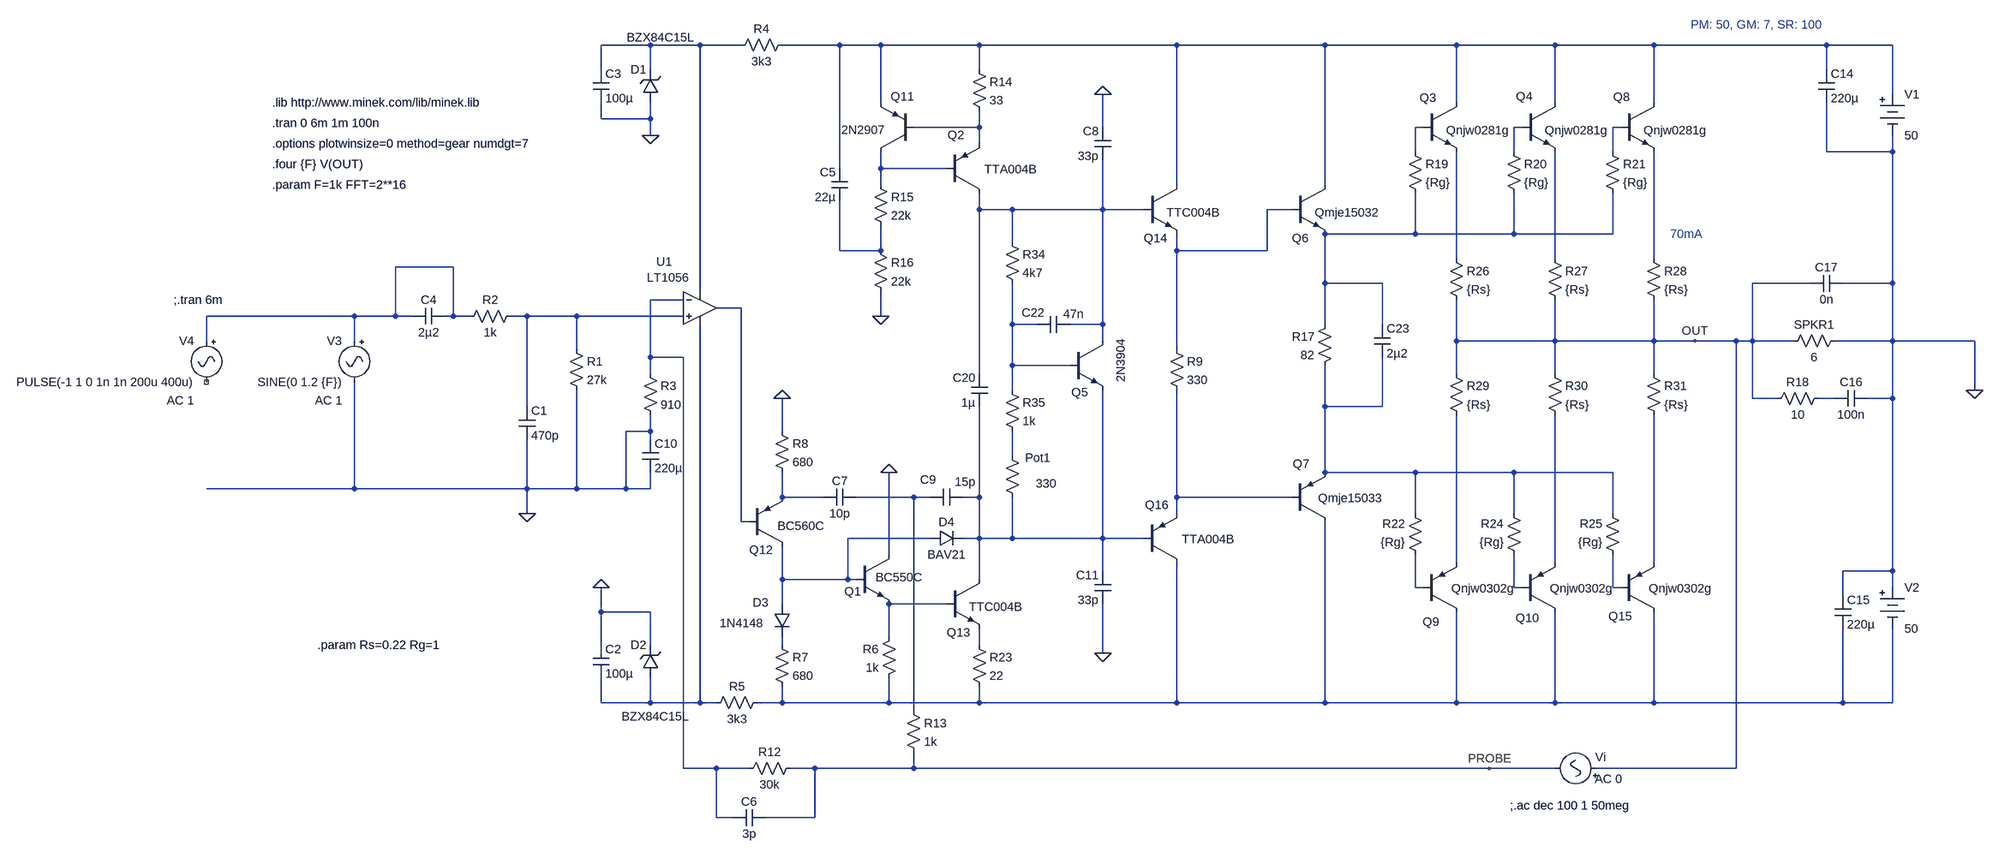
[diagram p0: schematic b44.triple.6.asc]
b44.triple.6.asc, the LTspice schematic file:
Version 4
SHEET 1 2228 832
WIRE -1952 -880 -2048 -880
WIRE -1856 -880 -1952 -880
WIRE -1776 -880 -1856 -880
WIRE -1584 -880 -1696 -880
WIRE -1504 -880 -1584 -880
WIRE -1312 -880 -1504 -880
WIRE -928 -880 -1312 -880
WIRE -640 -880 -928 -880
WIRE -384 -880 -640 -880
WIRE -192 -880 -384 -880
WIRE 0 -880 -192 -880
WIRE 336 -880 0 -880
WIRE 464 -880 336 -880
WIRE -2048 -832 -2048 -880
WIRE -1952 -832 -1952 -880
WIRE -1312 -832 -1312 -880
WIRE 336 -832 336 -880
WIRE 464 -784 464 -880
WIRE -1504 -768 -1504 -880
WIRE -384 -768 -384 -880
WIRE -192 -768 -192 -880
WIRE 0 -768 0 -880
WIRE -2048 -736 -2048 -768
WIRE -1952 -736 -1952 -768
WIRE -1952 -736 -2048 -736
WIRE -1312 -720 -1312 -752
WIRE -1312 -720 -1440 -720
WIRE -1072 -720 -1072 -784
WIRE -448 -720 -464 -720
WIRE -256 -720 -272 -720
WIRE -64 -720 -80 -720
WIRE -1952 -704 -1952 -736
WIRE -1312 -688 -1312 -720
WIRE -464 -672 -464 -720
WIRE -272 -672 -272 -720
WIRE -80 -672 -80 -720
WIRE 336 -672 336 -768
WIRE 464 -672 464 -704
WIRE 464 -672 336 -672
WIRE -1584 -640 -1584 -880
WIRE -1504 -640 -1504 -672
WIRE -1376 -640 -1504 -640
WIRE -1504 -608 -1504 -640
WIRE -928 -608 -928 -880
WIRE -640 -608 -640 -880
WIRE -1312 -560 -1312 -592
WIRE -1248 -560 -1312 -560
WIRE -1072 -560 -1072 -656
WIRE -1072 -560 -1248 -560
WIRE -992 -560 -1072 -560
WIRE -704 -560 -752 -560
WIRE -464 -512 -464 -592
WIRE -464 -512 -640 -512
WIRE -272 -512 -272 -592
WIRE -272 -512 -464 -512
WIRE -80 -512 -80 -592
WIRE -80 -512 -272 -512
WIRE -1248 -496 -1248 -560
WIRE -1584 -480 -1584 -576
WIRE -1504 -480 -1504 -528
WIRE -1504 -480 -1584 -480
WIRE -928 -480 -928 -512
WIRE -752 -480 -752 -560
WIRE -752 -480 -928 -480
WIRE -384 -464 -384 -672
WIRE -192 -464 -192 -672
WIRE 0 -464 0 -672
WIRE -2336 -448 -2448 -448
WIRE -640 -416 -640 -512
WIRE -528 -416 -640 -416
WIRE 304 -416 192 -416
WIRE 464 -416 464 -672
WIRE 464 -416 368 -416
WIRE -1856 -400 -1856 -880
WIRE -1888 -384 -1952 -384
WIRE -1776 -368 -1824 -368
WIRE -2528 -352 -2816 -352
WIRE -2448 -352 -2448 -448
WIRE -2448 -352 -2528 -352
WIRE -2416 -352 -2448 -352
WIRE -2336 -352 -2336 -448
WIRE -2336 -352 -2352 -352
WIRE -2304 -352 -2336 -352
WIRE -2192 -352 -2224 -352
WIRE -2096 -352 -2192 -352
WIRE -1888 -352 -2096 -352
WIRE -1504 -352 -1504 -400
WIRE -1248 -336 -1248 -416
WIRE -1200 -336 -1248 -336
WIRE -1072 -336 -1072 -560
WIRE -1072 -336 -1136 -336
WIRE -640 -336 -640 -416
WIRE -528 -336 -528 -416
WIRE -2816 -304 -2816 -352
WIRE -2528 -304 -2528 -352
WIRE -1072 -304 -1072 -336
WIRE -384 -304 -384 -384
WIRE -192 -304 -192 -384
WIRE -192 -304 -384 -304
WIRE 0 -304 0 -384
WIRE 0 -304 -192 -304
WIRE 80 -304 0 -304
WIRE 160 -304 80 -304
WIRE 192 -304 192 -416
WIRE 192 -304 160 -304
WIRE 272 -304 192 -304
WIRE 464 -304 464 -416
WIRE 464 -304 352 -304
WIRE 624 -304 464 -304
WIRE -2096 -288 -2096 -352
WIRE -928 -288 -928 -480
WIRE -1952 -272 -1952 -384
WIRE -1888 -272 -1952 -272
WIRE -1248 -256 -1248 -336
WIRE -1136 -256 -1248 -256
WIRE -1952 -240 -1952 -272
WIRE -1312 -240 -1312 -560
WIRE -384 -240 -384 -304
WIRE -192 -240 -192 -304
WIRE 0 -240 0 -304
WIRE -1248 -208 -1248 -256
WIRE 624 -208 624 -304
WIRE 192 -192 192 -304
WIRE 240 -192 192 -192
WIRE 352 -192 320 -192
WIRE 464 -192 464 -304
WIRE 464 -192 416 -192
WIRE -2192 -176 -2192 -352
WIRE -640 -176 -640 -256
WIRE -528 -176 -528 -272
WIRE -528 -176 -640 -176
WIRE -1952 -128 -1952 -160
WIRE -1952 -128 -2000 -128
WIRE -1696 -128 -1696 -192
WIRE -1952 -112 -1952 -128
WIRE -1248 -80 -1248 -128
WIRE -640 -48 -640 -176
WIRE -464 -48 -640 -48
WIRE -272 -48 -464 -48
WIRE -80 -48 -272 -48
WIRE -2528 -16 -2528 -224
WIRE -2528 -16 -2816 -16
WIRE -2192 -16 -2192 -112
WIRE -2192 -16 -2528 -16
WIRE -2096 -16 -2096 -208
WIRE -2096 -16 -2192 -16
WIRE -2000 -16 -2000 -128
WIRE -2000 -16 -2096 -16
WIRE -1952 -16 -1952 -48
WIRE -1952 -16 -2000 -16
WIRE -1696 0 -1696 -48
WIRE -1616 0 -1696 0
WIRE -1440 0 -1552 0
WIRE -1408 0 -1440 0
WIRE -1312 0 -1312 -176
WIRE -1312 0 -1344 0
WIRE -928 0 -928 -208
WIRE -704 0 -928 0
WIRE -2192 32 -2192 -16
WIRE -928 32 -928 0
WIRE -464 32 -464 -48
WIRE -272 32 -272 -48
WIRE -80 32 -80 -48
WIRE -1776 48 -1776 -368
WIRE -1760 48 -1776 48
WIRE -1408 80 -1568 80
WIRE -1312 80 -1312 0
WIRE -1312 80 -1344 80
WIRE -1248 80 -1248 0
WIRE -1248 80 -1312 80
WIRE -1072 80 -1072 -208
WIRE -1072 80 -1248 80
WIRE -992 80 -1072 80
WIRE -1488 112 -1488 -48
WIRE -384 128 -384 -160
WIRE -192 128 -192 -160
WIRE 0 128 0 -160
WIRE -1072 144 -1072 80
WIRE 464 144 464 -192
WIRE 464 144 368 144
WIRE -1696 160 -1696 96
WIRE -1568 160 -1568 80
WIRE -1568 160 -1696 160
WIRE -1552 160 -1568 160
WIRE -1312 160 -1312 80
WIRE -464 176 -464 112
WIRE -448 176 -464 176
WIRE -272 176 -272 112
WIRE -256 176 -272 176
WIRE -80 176 -80 112
WIRE -64 176 -80 176
WIRE 464 176 464 144
WIRE 368 192 368 144
WIRE -1696 208 -1696 160
WIRE -1376 208 -1488 208
WIRE -2048 224 -2048 176
WIRE -1952 224 -2048 224
WIRE -1488 272 -1488 208
WIRE -2048 288 -2048 224
WIRE -1952 288 -1952 224
WIRE -1696 288 -1696 272
WIRE -1312 288 -1312 256
WIRE -1072 304 -1072 208
WIRE -2048 400 -2048 352
WIRE -1952 400 -1952 352
WIRE -1952 400 -2048 400
WIRE -1856 400 -1856 -336
WIRE -1856 400 -1952 400
WIRE -1824 400 -1856 400
WIRE -1696 400 -1696 368
WIRE -1696 400 -1744 400
WIRE -1488 400 -1488 352
WIRE -1488 400 -1696 400
WIRE -1312 400 -1312 368
WIRE -1312 400 -1488 400
WIRE -928 400 -928 128
WIRE -928 400 -1312 400
WIRE -640 400 -640 48
WIRE -640 400 -928 400
WIRE -384 400 -384 224
WIRE -384 400 -640 400
WIRE -192 400 -192 224
WIRE -192 400 -384 400
WIRE 0 400 0 224
WIRE 0 400 -192 400
WIRE 368 400 368 256
WIRE 368 400 0 400
WIRE 464 400 464 256
WIRE 464 400 368 400
WIRE -1440 416 -1440 0
WIRE -1888 528 -1888 -272
WIRE -1824 528 -1888 528
WIRE -1760 528 -1824 528
WIRE -1632 528 -1680 528
WIRE -1440 528 -1440 496
WIRE -1440 528 -1632 528
WIRE -320 528 -1440 528
WIRE -192 528 -320 528
WIRE 160 528 160 -304
WIRE 160 528 -112 528
WIRE -1824 624 -1824 528
WIRE -1792 624 -1824 624
WIRE -1632 624 -1632 528
WIRE -1632 624 -1728 624
FLAG 624 -208 0
FLAG 80 -304 OUT
FLAG -320 528 PROBE
FLAG -2192 32 0
FLAG -2048 176 0
FLAG -1952 -704 0
FLAG -1696 -192 0
FLAG -1504 -352 0
FLAG -1488 -48 0
FLAG -1072 -784 0
FLAG -1072 304 0
SYMBOL res -624 -352 M0
SYMATTR InstName R17
SYMATTR Value 82
SYMATTR SpiceLine pwr=0.5
SYMBOL Misc\\battery 464 -800 R0
WINDOW 123 0 0 Left 2
WINDOW 39 0 0 Left 2
SYMATTR InstName V1
SYMATTR Value 50
SYMBOL Misc\\battery 464 160 R0
WINDOW 123 0 0 Left 2
WINDOW 39 0 0 Left 2
SYMATTR InstName V2
SYMATTR Value 50
SYMBOL res 368 -320 R90
WINDOW 0 0 56 VBottom 2
WINDOW 3 32 56 VTop 2
SYMATTR InstName SPKR1
SYMATTR Value 6
SYMBOL cap 320 -832 R0
SYMATTR InstName C14
SYMATTR Value 220µ
SYMATTR SpiceLine V=63
SYMBOL cap 352 192 R0
SYMATTR InstName C15
SYMATTR Value 220µ
SYMATTR SpiceLine V=63
SYMBOL res 224 -176 R270
WINDOW 0 32 56 VTop 2
WINDOW 3 0 56 VBottom 2
SYMATTR InstName R18
SYMATTR Value 10
SYMATTR SpiceLine pwr=2
SYMBOL cap 352 -176 R270
WINDOW 0 32 32 VTop 2
WINDOW 3 0 32 VBottom 2
SYMATTR InstName C16
SYMATTR Value 100n
SYMATTR SpiceLine V=200
SYMBOL res -480 -688 R0
SYMATTR InstName R19
SYMATTR Value {Rg}
SYMBOL res -288 -688 R0
SYMATTR InstName R20
SYMATTR Value {Rg}
SYMBOL res -96 -688 R0
SYMATTR InstName R21
SYMATTR Value {Rg}
SYMBOL res -448 128 R180
WINDOW 0 36 76 Left 2
WINDOW 3 36 40 Left 2
SYMATTR InstName R22
SYMATTR Value {Rg}
SYMBOL res -256 128 R180
WINDOW 0 36 76 Left 2
WINDOW 3 36 40 Left 2
SYMATTR InstName R24
SYMATTR Value {Rg}
SYMBOL res -64 128 R180
WINDOW 0 36 76 Left 2
WINDOW 3 36 40 Left 2
SYMATTR InstName R25
SYMATTR Value {Rg}
SYMBOL res -400 -480 R0
SYMATTR InstName R26
SYMATTR Value {Rs}
SYMATTR SpiceLine pwr=2
SYMBOL res -208 -480 R0
SYMATTR InstName R27
SYMATTR Value {Rs}
SYMATTR SpiceLine pwr=2
SYMBOL res -16 -480 R0
SYMATTR InstName R28
SYMATTR Value {Rs}
SYMATTR SpiceLine pwr=2
SYMBOL cap 304 -400 R270
WINDOW 0 32 32 VTop 2
WINDOW 3 0 32 VBottom 2
SYMATTR InstName C17
SYMATTR Value 0n
SYMBOL res -400 -256 R0
SYMATTR InstName R29
SYMATTR Value {Rs}
SYMATTR SpiceLine pwr=2
SYMBOL res -208 -256 R0
SYMATTR InstName R30
SYMATTR Value {Rs}
SYMATTR SpiceLine pwr=2
SYMBOL res -16 -256 R0
SYMATTR InstName R31
SYMATTR Value {Rs}
SYMATTR SpiceLine pwr=2
SYMBOL Misc\\signal -96 528 M270
WINDOW 123 -21 19 VLeft 2
WINDOW 3 24 104 Invisible 2
WINDOW 0 22 18 VLeft 2
WINDOW 39 0 0 Left 0
SYMATTR Value2 AC 0
SYMATTR Value 0
SYMATTR InstName Vi
SYMBOL res -1264 -512 R0
SYMATTR InstName R34
SYMATTR Value 4k7
SYMBOL res -1264 -96 R0
WINDOW 0 41 20 Left 2
WINDOW 3 62 70 Left 2
SYMATTR InstName Pot1
SYMATTR Value 330
SYMBOL res -1264 -224 R0
SYMATTR InstName R35
SYMATTR Value 1k
SYMBOL npn -1136 -304 R0
WINDOW 0 3 100 Left 2
WINDOW 3 99 -4 VRight 2
SYMATTR InstName Q5
SYMATTR Value 2N3904
SYMBOL npn -704 -608 R0
WINDOW 0 0 104 Left 2
WINDOW 3 44 54 Left 2
SYMATTR InstName Q6
SYMATTR Value Qmje15032
SYMBOL pnp -704 48 M180
WINDOW 0 2 113 Left 2
WINDOW 3 176 46 Right 2
SYMATTR InstName Q7
SYMATTR Value Qmje15033
SYMBOL cap -1200 -320 R270
WINDOW 0 23 -8 VTop 2
WINDOW 3 52 71 VBottom 2
SYMATTR InstName C22
SYMATTR Value 47n
SYMBOL cap -544 -336 R0
SYMATTR InstName C23
SYMATTR Value 2µ2
SYMATTR SpiceLine V=100
SYMBOL cap -1296 -240 M0
SYMATTR InstName C20
SYMATTR Value 1µ
SYMATTR SpiceLine V=100
SYMBOL npn -448 -768 R0
WINDOW 0 -8 -9 Left 2
WINDOW 3 44 54 Left 2
SYMATTR InstName Q3
SYMATTR Value Qnjw0281g
SYMBOL npn -256 -768 R0
WINDOW 0 -12 -12 Left 2
WINDOW 3 44 54 Left 2
SYMATTR InstName Q4
SYMATTR Value Qnjw0281g
SYMBOL npn -64 -768 R0
WINDOW 0 -15 -11 Left 2
WINDOW 3 44 54 Left 2
SYMATTR InstName Q8
SYMATTR Value Qnjw0281g
SYMBOL pnp -448 224 M180
WINDOW 0 -2 -19 Left 2
WINDOW 3 176 46 Right 2
SYMATTR InstName Q9
SYMATTR Value Qnjw0302g
SYMBOL pnp -256 224 M180
WINDOW 0 -13 -11 Left 2
WINDOW 3 176 46 Right 2
SYMATTR InstName Q10
SYMATTR Value Qnjw0302g
SYMBOL pnp -64 224 M180
WINDOW 0 -24 -8 Left 2
WINDOW 3 176 46 Right 2
SYMATTR InstName Q15
SYMATTR Value Qnjw0302g
SYMBOL res -2112 -304 R0
SYMATTR InstName R1
SYMATTR Value 27k
SYMBOL cap -2208 -176 R0
SYMATTR InstName C1
SYMATTR Value 470p
SYMBOL res -2208 -368 R90
WINDOW 0 0 56 VBottom 2
WINDOW 3 32 56 VTop 2
SYMATTR InstName R2
SYMATTR Value 1k
SYMBOL Misc\\signal -2528 -320 M0
WINDOW 123 24 132 Left 2
WINDOW 39 0 0 Left 0
SYMATTR Value2 AC 1
SYMATTR InstName V3
SYMATTR Value SINE(0 1.2 {F})
SYMBOL Opamps\\LT1056 -1856 -432 R0
WINDOW 0 -85 -26 Left 2
WINDOW 3 -103 5 Left 2
SYMATTR InstName U1
SYMBOL res -1968 -256 R0
SYMATTR InstName R3
SYMATTR Value 910
SYMBOL res -1680 -896 R90
WINDOW 0 0 56 VBottom 2
WINDOW 3 32 56 VTop 2
SYMATTR InstName R4
SYMATTR Value 3k3
SYMATTR SpiceLine pwr=0.5
SYMBOL res -1728 384 R90
WINDOW 0 0 56 VBottom 2
WINDOW 3 32 56 VTop 2
SYMATTR InstName R5
SYMATTR Value 3k3
SYMATTR SpiceLine pwr=0.5
SYMBOL cap -2064 288 R0
SYMATTR InstName C2
SYMATTR Value 100µ
SYMATTR SpiceLine V=25
SYMBOL cap -2064 -832 R0
SYMATTR InstName C3
SYMATTR Value 100µ
SYMATTR SpiceLine V=25
SYMBOL zener -1936 -768 R180
WINDOW 0 24 64 Left 2
WINDOW 3 -69 127 Left 2
SYMATTR InstName D1
SYMATTR Value BZX84C15L
SYMATTR Description Diode
SYMATTR Type diode
SYMBOL zener -1936 352 R180
WINDOW 0 24 64 Left 2
WINDOW 3 -59 -75 Left 2
SYMATTR InstName D2
SYMATTR Value BZX84C15L
SYMATTR Description Diode
SYMATTR Type diode
SYMBOL res -1472 256 M0
SYMATTR InstName R6
SYMATTR Value 1k
SYMBOL res -1712 272 R0
SYMATTR InstName R7
SYMATTR Value 680
SYMBOL npn -1552 112 R0
WINDOW 0 -23 72 Left 2
WINDOW 3 38 44 Left 2
SYMATTR InstName Q1
SYMATTR Value BC550C
SYMBOL Misc\\signal -2816 -320 M0
WINDOW 123 24 132 Left 2
WINDOW 39 0 0 Left 2
SYMATTR Value2 AC 1
SYMATTR InstName V4
SYMATTR Value PULSE(-1 1 0 1n 1n 200u 400u)
SYMBOL cap -2352 -368 R90
WINDOW 0 0 32 VBottom 2
WINDOW 3 32 32 VTop 2
SYMATTR InstName C4
SYMATTR Value 2µ2
SYMBOL res -1712 -144 R0
SYMATTR InstName R8
SYMATTR Value 680
SYMBOL diode -1712 208 R0
WINDOW 0 -41 -3 Left 2
WINDOW 3 -105 37 Left 2
SYMATTR InstName D3
SYMATTR Value 1N4148
SYMBOL res -1664 512 R90
WINDOW 0 0 56 VBottom 2
WINDOW 3 32 56 VTop 2
SYMATTR InstName R12
SYMATTR Value 30k
SYMBOL res -1456 400 R0
SYMATTR InstName R13
SYMATTR Value 1k
SYMBOL pnp -1440 -672 R180
WINDOW 0 -1 108 Left 2
WINDOW 3 141 43 Right 2
SYMATTR InstName Q11
SYMATTR Value 2N2907
SYMBOL res -1328 -848 R0
SYMATTR InstName R14
SYMATTR Value 33
SYMBOL res -1520 -624 R0
SYMATTR InstName R15
SYMATTR Value 22k
SYMBOL res -1520 -496 R0
SYMATTR InstName R16
SYMATTR Value 22k
SYMBOL cap -1568 -640 M0
SYMATTR InstName C5
SYMATTR Value 22µ
SYMATTR SpiceLine V=25
SYMBOL cap -1728 608 R90
WINDOW 0 0 32 VBottom 2
WINDOW 3 32 32 VTop 2
SYMATTR InstName C6
SYMATTR Value 3p
SYMBOL pnp -1760 96 M180
WINDOW 0 0 -7 Left 2
WINDOW 3 146 40 Right 2
SYMATTR InstName Q12
SYMATTR Value BC560C
SYMBOL res -1328 272 R0
SYMATTR InstName R23
SYMATTR Value 22
SYMBOL cap -1552 -16 R90
WINDOW 0 0 32 VBottom 2
WINDOW 3 32 32 VTop 2
SYMATTR InstName C7
SYMATTR Value 10p
SYMBOL cap -1344 -16 R90
WINDOW 0 -2 68 VBottom 2
WINDOW 3 -29 -4 VTop 2
SYMATTR InstName C9
SYMATTR Value 15p
SYMBOL diode -1408 96 R270
WINDOW 0 32 32 VTop 2
WINDOW 3 0 32 VBottom 2
SYMATTR InstName D4
SYMATTR Value BAV21
SYMBOL cap -1968 -112 R0
SYMATTR InstName C10
SYMATTR Value 220µ
SYMBOL pnp -1376 -592 M180
WINDOW 0 2 113 Left 2
WINDOW 3 176 46 Right 2
SYMATTR InstName Q2
SYMATTR Value TTA004B
SYMBOL npn -1376 160 R0
WINDOW 0 0 104 Left 2
WINDOW 3 44 54 Left 2
SYMATTR InstName Q13
SYMATTR Value TTC004B
SYMBOL res -944 -304 R0
SYMATTR InstName R9
SYMATTR Value 330
SYMBOL npn -992 -608 R0
WINDOW 0 0 104 Left 2
WINDOW 3 44 54 Left 2
SYMATTR InstName Q14
SYMATTR Value TTC004B
SYMBOL pnp -992 128 M180
WINDOW 0 2 113 Left 2
WINDOW 3 176 46 Right 2
SYMATTR InstName Q16
SYMATTR Value TTA004B
SYMBOL cap -1056 -720 M0
SYMATTR InstName C8
SYMATTR Value 33p
SYMATTR SpiceLine V=100
SYMBOL cap -1056 144 M0
SYMATTR InstName C11
SYMATTR Value 33p
SYMATTR SpiceLine V=100
TEXT -280 600 Left 2 !;.ac dec 100 1 50meg
TEXT 32 -512 Left 2 ;70mA
TEXT -2688 -768 Left 2 !.lib http://www.minek.com/lib/minek.lib
TEXT -2688 -728 Left 2 !.tran 0 6m 1m 100n
TEXT -2688 -688 Left 2 !.options plotwinsize=0 method=gear numdgt=7
TEXT -2688 -648 Left 2 !.four {F} V(OUT)
TEXT -2688 -608 Left 2 !.param F=1k FFT=2**16
TEXT -2880 -384 Left 2 !;.tran 6m
TEXT -2600 288 Left 2 !.param Rs=0.22 Rg=1
TEXT 72 -920 Left 2 ;PM: 50, GM: 7, SR: 100

The netlist it stands for:
* b44.triple.6.asc
R17 N010 N021 82 pwr=0.5
V1 N002 0 50
V2 0 N038 50
R§SPKR1 0 OUT 6
C14 N002 0 220µ V=63
C15 0 N038 220µ V=63
R18 OUT N020 10 pwr=2
C16 N020 0 100n V=200
R19 N004 N010 {Rg}
R20 N005 N010 {Rg}
R21 N006 N010 {Rg}
R22 N031 N021 {Rg}
R24 N032 N021 {Rg}
R25 N033 N021 {Rg}
R26 N012 OUT {Rs} pwr=2
R27 N013 OUT {Rs} pwr=2
R28 N014 OUT {Rs} pwr=2
C17 OUT 0 0n
R29 OUT N028 {Rs} pwr=2
R30 OUT N029 {Rs} pwr=2
R31 OUT N030 {Rs} pwr=2
Vi OUT PROBE 0 AC 0
R34 N008 N019 4k7
R§Pot1 N022 N025 330
R35 N019 N022 1k
Q5 N008 N019 N025 0 2N3904
Q6 N002 N009 N010 0 Qmje15032
Q7 N038 N026 N021 0 Qmje15033
C22 N019 N008 47n
C23 N010 N021 2µ2 V=100
C20 N008 N025 1µ V=100
Q3 N002 N004 N012 0 Qnjw0281g
Q4 N002 N005 N013 0 Qnjw0281g
Q8 N002 N006 N014 0 Qnjw0281g
Q9 N038 N031 N028 0 Qnjw0302g
Q10 N038 N032 N029 0 Qnjw0302g
Q15 N038 N033 N030 0 Qnjw0302g
R1 N018 0 27k
C1 N018 0 470p
R2 N018 N015 1k
V3 N015 0 SINE(0 1.2 {F}) AC 1
XU1 N018 N016 N001 N037 N017 LT1056  ; pins In+ In- V+ V- OUT
R3 N016 0 910
R4 N002 N001 3k3 pwr=0.5
R5 N038 N037 3k3 pwr=0.5
C2 0 N037 100µ V=25
C3 N001 0 100µ V=25
D1 0 N001 BZX84C15L
D2 N037 0 BZX84C15L
R6 N034 N038 1k
R7 N035 N038 680
Q1 0 N027 N034 0 BC550C
V4 N015 NC_01 PULSE(-1 1 0 1n 1n 200u 400u) AC 1
C4 N015 N015 2µ2
R8 0 N023 680
D3 N027 N035 1N4148
R12 PROBE N016 30k
R13 N024 PROBE 1k
Q11 N007 N003 N002 0 2N2907
R14 N002 N003 33
R15 N007 N011 22k
R16 N011 0 22k
C5 N002 N011 22µ V=25
C6 PROBE N016 3p
Q12 N027 N017 N023 0 BC560C
R23 N036 N038 22
C7 N024 N023 10p
C9 N025 N024 15p
D4 N027 N025 BAV21
C10 0 0 220µ
Q2 N008 N007 N003 0 TTA004B
Q13 N025 N034 N036 0 TTC004B
R9 N009 N026 330
Q14 N002 N008 N009 0 TTC004B
Q16 N038 N025 N026 0 TTA004B
C8 0 N008 33p V=100
C11 N025 0 33p V=100
.model D D
.lib standard.dio
.model NPN NPN
.model PNP PNP
.lib standard.bjt
;.ac dec 100 1 50meg
* 70mA
.lib http://www.minek.com/lib/minek.lib
.tran 0 6m 1m 100n
.options plotwinsize=0 method=gear numdgt=7
.four {F} V(OUT)
.param F=1k FFT=2**16
;.tran 6m
.param Rs=0.22 Rg=1
* PM: 50, GM: 7, SR: 100
.backanno
.end